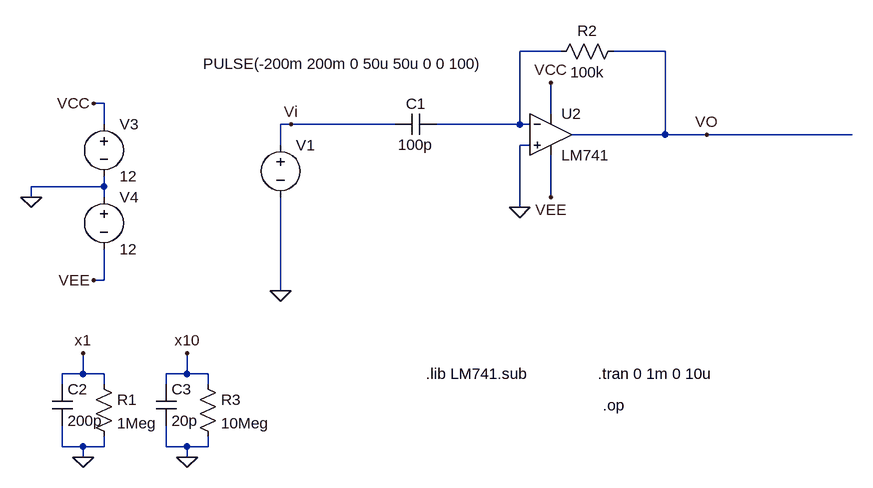
[diagram p0: schematic Diferenciador.asc]
Diferenciador.asc, the LTspice schematic file:
Version 4
SHEET 1 960 800
WIRE 384 160 320 160
WIRE 544 160 464 160
WIRE -320 240 -336 240
WIRE 368 256 368 208
WIRE -320 272 -320 240
WIRE -32 272 -48 272
WIRE 128 272 -32 272
WIRE 320 272 320 160
WIRE 320 272 192 272
WIRE 336 272 320 272
WIRE 544 288 544 160
WIRE 544 288 400 288
WIRE 608 288 544 288
WIRE 832 288 608 288
WIRE -48 304 -48 272
WIRE 336 304 320 304
WIRE -320 368 -320 352
WIRE -320 368 -432 368
WIRE -432 384 -432 368
WIRE -320 384 -320 368
WIRE 368 384 368 320
WIRE 320 400 320 304
WIRE -320 512 -320 464
WIRE -320 512 -336 512
WIRE -48 528 -48 384
WIRE -352 656 -352 624
WIRE -352 656 -384 656
WIRE -320 656 -352 656
WIRE -192 656 -192 624
WIRE -192 656 -224 656
WIRE -160 656 -192 656
WIRE -384 672 -384 656
WIRE -320 672 -320 656
WIRE -224 672 -224 656
WIRE -160 672 -160 656
WIRE -384 768 -384 736
WIRE -352 768 -384 768
WIRE -320 768 -320 752
WIRE -320 768 -352 768
WIRE -224 768 -224 736
WIRE -192 768 -224 768
WIRE -160 768 -160 752
WIRE -160 768 -192 768
WIRE -352 784 -352 768
WIRE -192 784 -192 768
FLAG 320 400 0
FLAG -48 528 0
FLAG -432 384 0
FLAG -336 512 VEE
FLAG -336 240 VCC
FLAG 368 384 VEE
FLAG 368 208 VCC
FLAG 608 288 VO
FLAG -32 272 Vi
FLAG -352 784 0
FLAG -192 784 0
FLAG -352 624 x1
FLAG -192 624 x10
SYMBOL res 480 144 R90
WINDOW 0 0 56 VBottom 2
WINDOW 3 32 56 VTop 2
SYMATTR InstName R2
SYMATTR Value 100k
SYMBOL voltage -48 288 R0
WINDOW 3 -119 -109 Left 2
SYMATTR Value PULSE(-200m 200m 0 50u 50u 0 0 100)
SYMATTR InstName V1
SYMBOL voltage -320 256 R0
SYMATTR InstName V3
SYMATTR Value 12
SYMBOL voltage -320 368 R0
SYMATTR InstName V4
SYMATTR Value 12
SYMBOL opamp2 368 224 R0
SYMATTR InstName U2
SYMATTR Value LM741
SYMBOL cap 192 256 R90
WINDOW 0 0 32 VBottom 2
WINDOW 3 32 32 VTop 2
SYMATTR InstName C1
SYMATTR Value 100p
SYMBOL cap -400 672 R0
SYMATTR InstName C2
SYMATTR Value 200p
SYMBOL cap -240 672 R0
SYMATTR InstName C3
SYMATTR Value 20p
SYMBOL res -336 656 R0
SYMATTR InstName R1
SYMATTR Value 1Meg
SYMBOL res -176 656 R0
SYMATTR InstName R3
SYMATTR Value 10Meg
TEXT 176 656 Left 2 !.lib LM741.sub
TEXT 440 656 Left 2 !.tran 0 1m 0 10u
TEXT 448 704 Left 2 !.op

The netlist it stands for:
* Diferenciador.asc
R2 VO N001 100k
V1 Vi 0 PULSE(-200m 200m 0 50u 50u 0 0 100)
V3 VCC 0 12
V4 0 VEE 12
XU2 0 N001 VCC VEE VO LM741  ; pins In+ In- V+ V- OUT
C1 N001 Vi 100p
C2 x1 0 200p
C3 x10 0 20p
R1 x1 0 1Meg
R3 x10 0 10Meg
.lib LM741.sub
.tran 0 1m 0 10u
.op
.backanno
.end